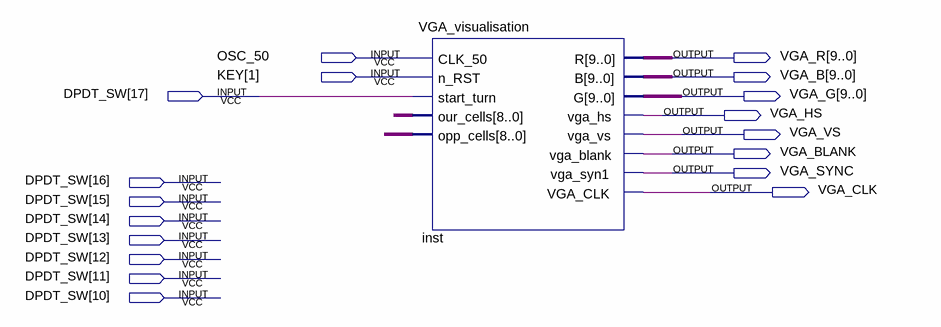
[diagram p0: schematic sheet]
// Quartus schematic VGA_TEST_BOARD.bdf as structural Verilog: 1 symbols, 18 pins
module VGA_TEST_BOARD (
  input  OSC_50,
  input  [1:1] KEY,
  input  [17:10] DPDT_SW,
  output [9:0] VGA_R,
  output [9:0] VGA_B,
  output [9:0] VGA_G,
  output VGA_HS,
  output VGA_VS,
  output VGA_BLANK,
  output VGA_SYNC,
  output VGA_CLK
);

  wire [8:0] undriven, undriven_2;

  VGA_visualisation inst (
    .CLK_50(OSC_50), .n_RST(KEY[1]), .start_turn(DPDT_SW[17]), .our_cells(undriven), .opp_cells(undriven_2),
    .R(VGA_R), .B(VGA_B), .G(VGA_G), .vga_hs(VGA_HS), .vga_vs(VGA_VS), .vga_blank(VGA_BLANK),
    .vga_syn1(VGA_SYNC), .VGA_CLK(VGA_CLK));
endmodule
